# Altium schematic sheet LCD Controller.SchDoc: TFT PMOD
size Tabloid; Date: 7/9/2017; DrawnBy: Dave McCoy; Engineer: Dave McCoy; DocumentNumber: 2; Revision: B; SheetNumber: 2; SheetTotal: 4
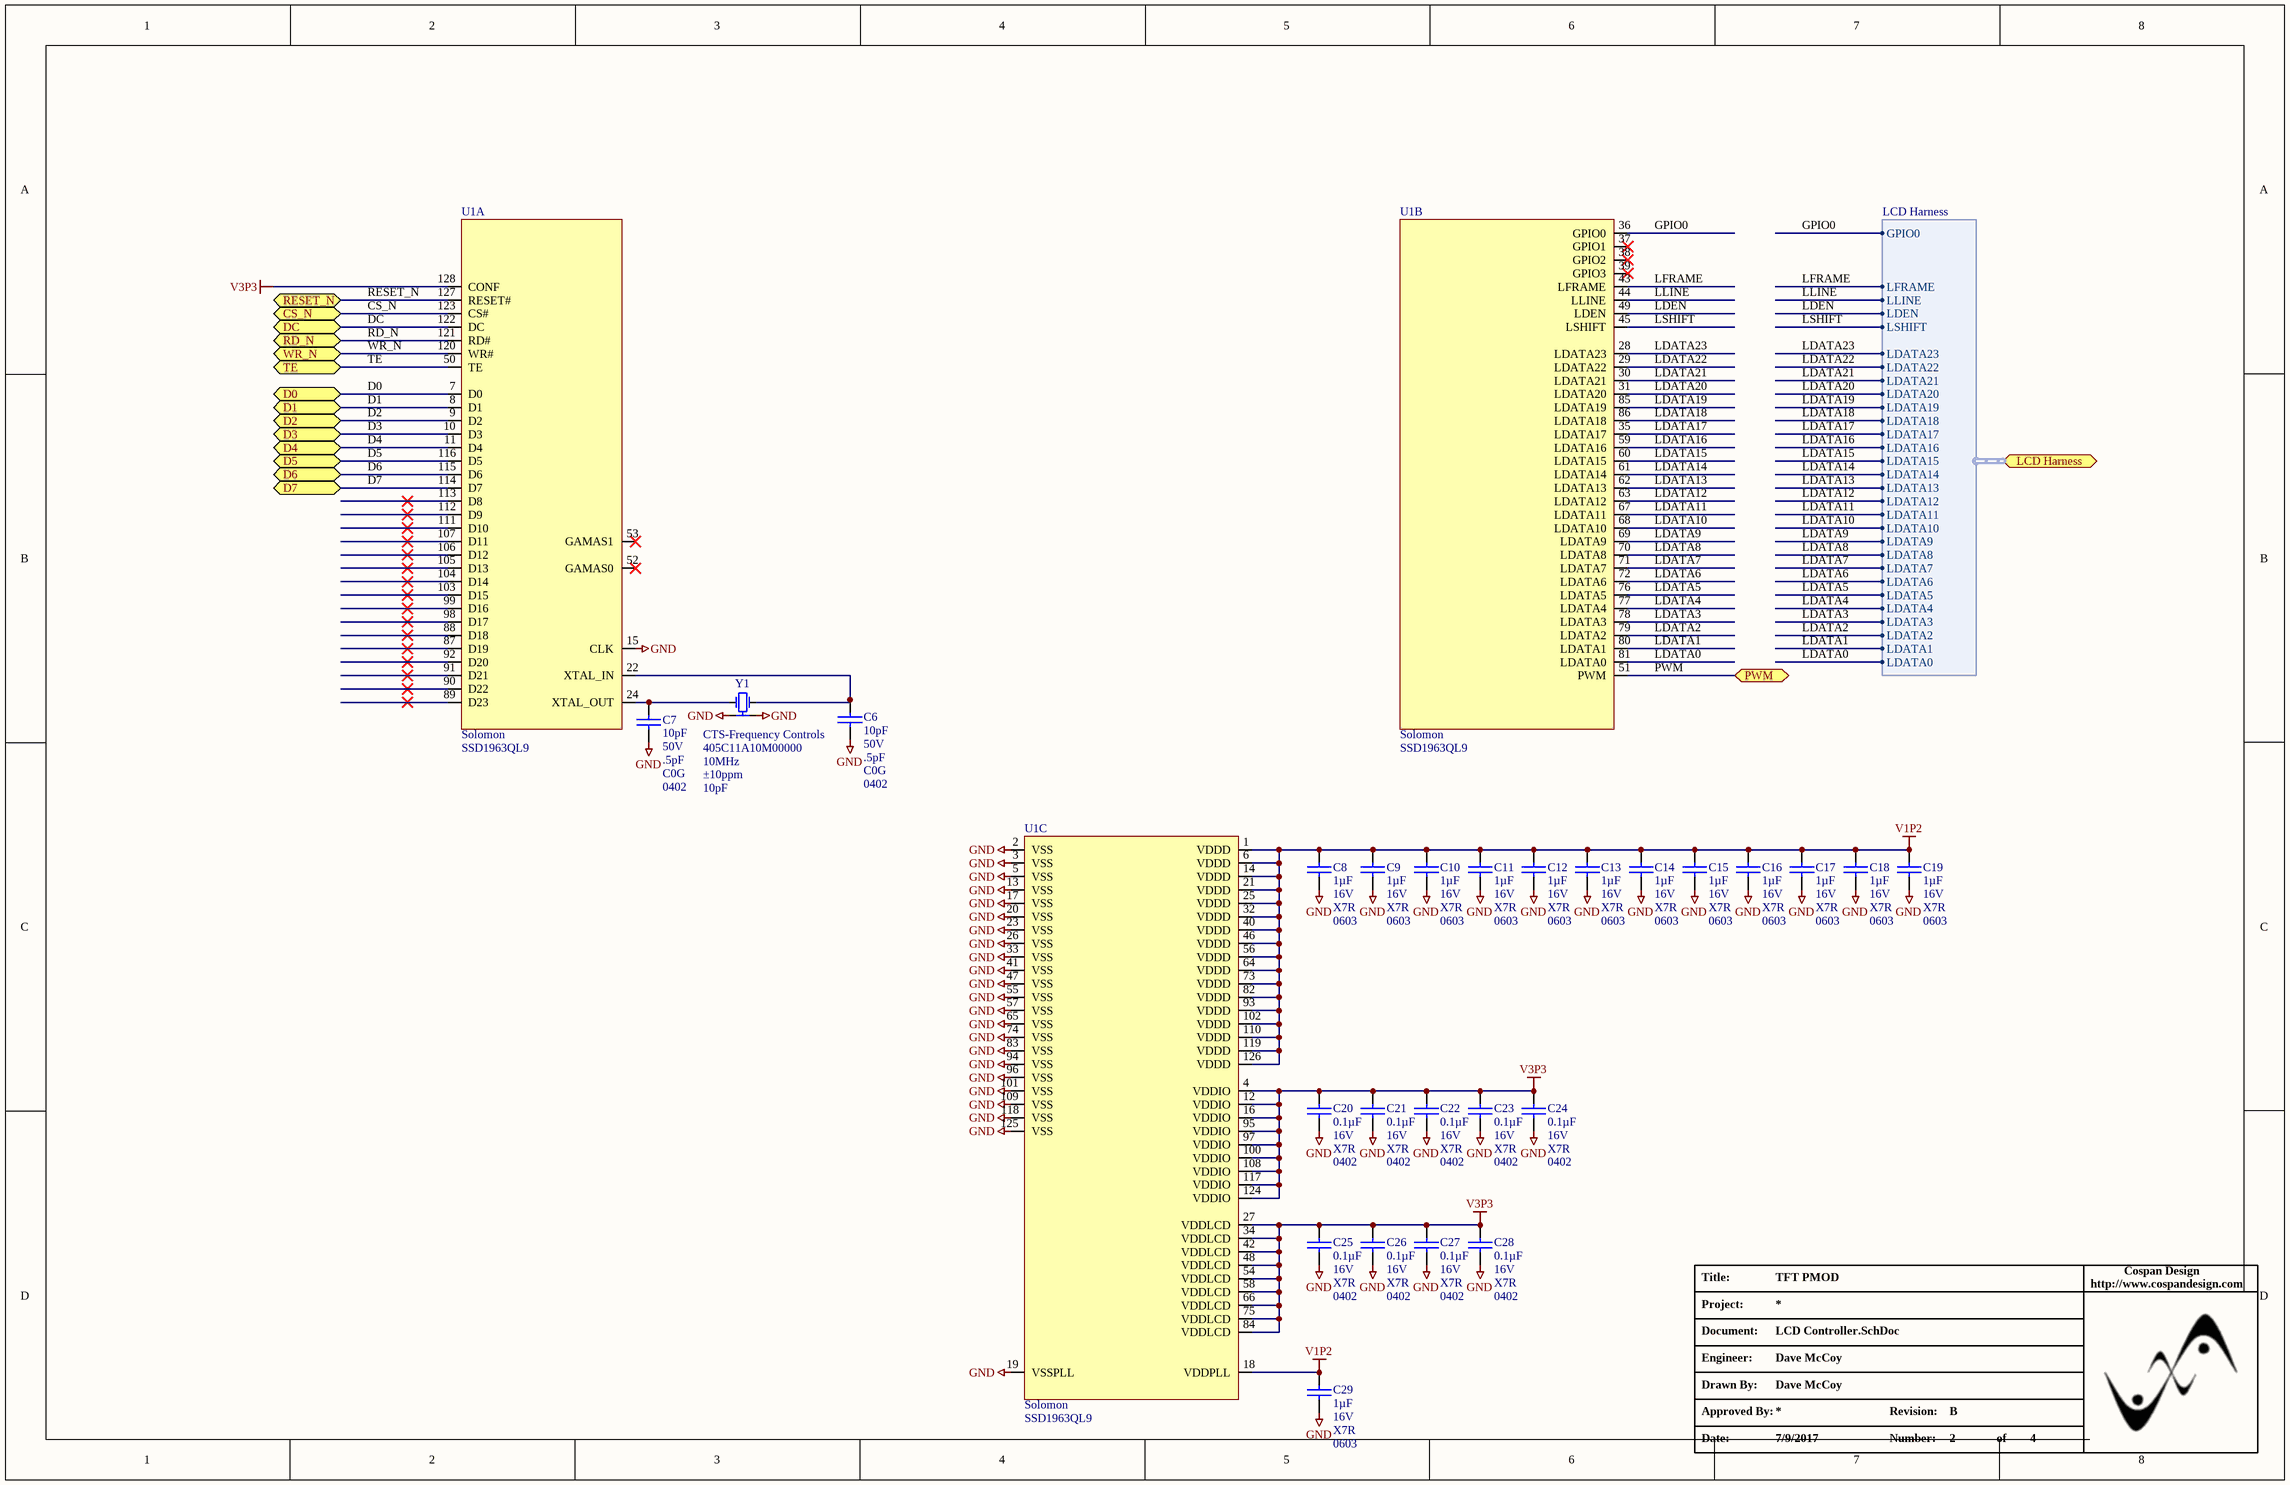
[diagram p0: LCD Controller.SchDoc]

## Parts
C6  Voltage - Rated: 50V  Tolerance: .5pF  Temperature Coefficient: C0G  Package / Case: 0402  [C_ERA-0402]  (hidden comment: 10pF)
C7  Voltage - Rated: 50V  Tolerance: .5pF  Temperature Coefficient: C0G  Package / Case: 0402  [C_ERA-0402]  (hidden comment: 10pF)
C8  Capacitance: 1µF  Voltage - Rated: 16V  Temperature Coefficient: X7R  Package / Case: 0603  [C_ERA-0603]  (hidden comment: C_0603_1µF_16V)
C9  Capacitance: 1µF  Voltage - Rated: 16V  Temperature Coefficient: X7R  Package / Case: 0603  [C_ERA-0603]  (hidden comment: C_0603_1µF_16V)
C10  Capacitance: 1µF  Voltage - Rated: 16V  Temperature Coefficient: X7R  Package / Case: 0603  [C_ERA-0603]  (hidden comment: C_0603_1µF_16V)
C11  Capacitance: 1µF  Voltage - Rated: 16V  Temperature Coefficient: X7R  Package / Case: 0603  [C_ERA-0603]  (hidden comment: C_0603_1µF_16V)
C12  Capacitance: 1µF  Voltage - Rated: 16V  Temperature Coefficient: X7R  Package / Case: 0603  [C_ERA-0603]  (hidden comment: C_0603_1µF_16V)
C13  Capacitance: 1µF  Voltage - Rated: 16V  Temperature Coefficient: X7R  Package / Case: 0603  [C_ERA-0603]  (hidden comment: C_0603_1µF_16V)
C14  Capacitance: 1µF  Voltage - Rated: 16V  Temperature Coefficient: X7R  Package / Case: 0603  [C_ERA-0603]  (hidden comment: C_0603_1µF_16V)
C15  Capacitance: 1µF  Voltage - Rated: 16V  Temperature Coefficient: X7R  Package / Case: 0603  [C_ERA-0603]  (hidden comment: C_0603_1µF_16V)
C16  Capacitance: 1µF  Voltage - Rated: 16V  Temperature Coefficient: X7R  Package / Case: 0603  [C_ERA-0603]  (hidden comment: C_0603_1µF_16V)
C17  Capacitance: 1µF  Voltage - Rated: 16V  Temperature Coefficient: X7R  Package / Case: 0603  [C_ERA-0603]  (hidden comment: C_0603_1µF_16V)
C18  Capacitance: 1µF  Voltage - Rated: 16V  Temperature Coefficient: X7R  Package / Case: 0603  [C_ERA-0603]  (hidden comment: C_0603_1µF_16V)
C19  Capacitance: 1µF  Voltage - Rated: 16V  Temperature Coefficient: X7R  Package / Case: 0603  [C_ERA-0603]  (hidden comment: C_0603_1µF_16V)
C20  Capacitance: 0.1µF  Voltage - Rated: 16V  Temperature Coefficient: X7R  Package / Case: 0402  [C_0402]  (hidden comment: 0.1uF)
C21  Capacitance: 0.1µF  Voltage - Rated: 16V  Temperature Coefficient: X7R  Package / Case: 0402  [C_0402]  (hidden comment: 0.1uF)
C22  Capacitance: 0.1µF  Voltage - Rated: 16V  Temperature Coefficient: X7R  Package / Case: 0402  [C_0402]  (hidden comment: 0.1uF)
C23  Capacitance: 0.1µF  Voltage - Rated: 16V  Temperature Coefficient: X7R  Package / Case: 0402  [C_0402]  (hidden comment: 0.1uF)
C24  Capacitance: 0.1µF  Voltage - Rated: 16V  Temperature Coefficient: X7R  Package / Case: 0402  [C_0402]  (hidden comment: 0.1uF)
C25  Capacitance: 0.1µF  Voltage - Rated: 16V  Temperature Coefficient: X7R  Package / Case: 0402  [C_0402]  (hidden comment: 0.1uF)
C26  Capacitance: 0.1µF  Voltage - Rated: 16V  Temperature Coefficient: X7R  Package / Case: 0402  [C_0402]  (hidden comment: 0.1uF)
C27  Capacitance: 0.1µF  Voltage - Rated: 16V  Temperature Coefficient: X7R  Package / Case: 0402  [C_0402]  (hidden comment: 0.1uF)
C28  Capacitance: 0.1µF  Voltage - Rated: 16V  Temperature Coefficient: X7R  Package / Case: 0402  [C_0402]  (hidden comment: 0.1uF)
C29  Capacitance: 1µF  Voltage - Rated: 16V  Temperature Coefficient: X7R  Package / Case: 0603  [C_ERA-0603]  (hidden comment: C_0603_1µF_16V)
U1  Manufacturer: Solomon  [LQFP128]  (hidden comment: U_SSD1963QL9)  (parts A,B,C of 3)
Y1  Manufacturer: CTS-Frequency Controls  Manufacturer Part Number: 405C11A10M00000  Frequency: 10MHz  Frequency Stability: ±10ppm  Load Capacitance: 10pF  [SMD_OSC_8MHZ]  (hidden comment: Y_SMD_10.00MHZ_10PF)

## Ports
CS_N, D0, D1, D2, D3, D4, D5, D6, D7, DC, LCD Harness (harness LCD Harness), PWM, RD_N, RESET_N, TE, WR_N

## Harnesses
LCD Harness: GPIO0, LFRAME, LLINE, LDEN, LSHIFT, LDATA0, LDATA1, LDATA2, LDATA3, LDATA4, LDATA5, LDATA6, LDATA7, LDATA8, LDATA9, LDATA10, LDATA11, LDATA12, LDATA13, LDATA14, LDATA15, LDATA16, LDATA17, LDATA18, LDATA19, LDATA20, LDATA21, LDATA22, LDATA23

## Nets
GND: C6.1 C7.1 C8.1 C9.1 C10.1 C11.1 C12.1 C13.1 C14.1 C15.1 C16.1 C17.1 C18.1 C19.1 C20.1 C21.1 C22.1 C23.1 C24.1 C25.1 C26.1 C27.1 C28.1 C29.1 U1.2(VSS) U1.3(VSS) U1.5(VSS) U1.13(VSS) U1.15(CLK) U1.17(VSS) U1.19(VSSPLL) U1.20(VSS) U1.23(VSS) U1.26(VSS) U1.33(VSS) U1.41(VSS) U1.47(VSS) U1.55(VSS) U1.57(VSS) U1.65(VSS) U1.74(VSS) U1.83(VSS) U1.94(VSS) U1.96(VSS) U1.101(VSS) U1.109(VSS) U1.118(VSS) U1.125(VSS) Y1.2 Y1.4
V1P2: C8.2 C9.2 C10.2 C11.2 C12.2 C13.2 C14.2 C15.2 C16.2 C17.2 C18.2 C19.2 C29.2 U1.1(VDDD) U1.6(VDDD) U1.14(VDDD) U1.18(VDDPLL) U1.21(VDDD) U1.25(VDDD) U1.32(VDDD) U1.40(VDDD) U1.46(VDDD) U1.56(VDDD) U1.64(VDDD) U1.73(VDDD) U1.82(VDDD) U1.93(VDDD) U1.102(VDDD) U1.110(VDDD) U1.119(VDDD) U1.126(VDDD)
V3P3: C20.2 C21.2 C22.2 C23.2 C24.2 C25.2 C26.2 C27.2 C28.2 U1.4(VDDIO) U1.12(VDDIO) U1.16(VDDIO) U1.27(VDDLCD) U1.34(VDDLCD) U1.42(VDDLCD) U1.48(VDDLCD) U1.54(VDDLCD) U1.58(VDDLCD) U1.66(VDDLCD) U1.75(VDDLCD) U1.84(VDDLCD) U1.95(VDDIO) U1.97(VDDIO) U1.100(VDDIO) U1.108(VDDIO) U1.117(VDDIO) U1.124(VDDIO) U1.128(CONF)
CS_N: U1.123(CS#) ; port CS_N
D0: U1.7(D0) ; port D0
D1: U1.8(D1) ; port D1
D2: U1.9(D2) ; port D2
D3: U1.10(D3) ; port D3
D4: U1.11(D4) ; port D4
D5: U1.116(D5) ; port D5
D6: U1.115(D6) ; port D6
D7: U1.114(D7) ; port D7
DC: U1.122(DC) ; port DC
GPIO0: U1.36(GPIO0) ; port LCD Harness.GPIO0
LDATA0: U1.81(LDATA0) ; port LCD Harness.LDATA0
LDATA1: U1.80(LDATA1) ; port LCD Harness.LDATA1
LDATA2: U1.79(LDATA2) ; port LCD Harness.LDATA2
LDATA3: U1.78(LDATA3) ; port LCD Harness.LDATA3
LDATA4: U1.77(LDATA4) ; port LCD Harness.LDATA4
LDATA5: U1.76(LDATA5) ; port LCD Harness.LDATA5
LDATA6: U1.72(LDATA6) ; port LCD Harness.LDATA6
LDATA7: U1.71(LDATA7) ; port LCD Harness.LDATA7
LDATA8: U1.70(LDATA8) ; port LCD Harness.LDATA8
LDATA9: U1.69(LDATA9) ; port LCD Harness.LDATA9
LDATA10: U1.68(LDATA10) ; port LCD Harness.LDATA10
LDATA11: U1.67(LDATA11) ; port LCD Harness.LDATA11
LDATA12: U1.63(LDATA12) ; port LCD Harness.LDATA12
LDATA13: U1.62(LDATA13) ; port LCD Harness.LDATA13
LDATA14: U1.61(LDATA14) ; port LCD Harness.LDATA14
LDATA15: U1.60(LDATA15) ; port LCD Harness.LDATA15
LDATA16: U1.59(LDATA16) ; port LCD Harness.LDATA16
LDATA17: U1.35(LDATA17) ; port LCD Harness.LDATA17
LDATA18: U1.86(LDATA18) ; port LCD Harness.LDATA18
LDATA19: U1.85(LDATA19) ; port LCD Harness.LDATA19
LDATA20: U1.31(LDATA20) ; port LCD Harness.LDATA20
LDATA21: U1.30(LDATA21) ; port LCD Harness.LDATA21
LDATA22: U1.29(LDATA22) ; port LCD Harness.LDATA22
LDATA23: U1.28(LDATA23) ; port LCD Harness.LDATA23
LDEN: U1.49(LDEN) ; port LCD Harness.LDEN
LFRAME: U1.43(LFRAME) ; port LCD Harness.LFRAME
LLINE: U1.44(LLINE) ; port LCD Harness.LLINE
LSHIFT: U1.45(LSHIFT) ; port LCD Harness.LSHIFT
PWM: U1.51(PWM) ; port PWM
RD_N: U1.121(RD#) ; port RD_N
RESET_N: U1.127(RESET#) ; port RESET_N
TE: U1.50(TE) ; port TE
WR_N: U1.120(WR#) ; port WR_N
NetC6_2: C6.2 U1.22(XTAL_IN) Y1.3
NetC7_2: C7.2 U1.24(XTAL_OUT) Y1.1

Not connected (* = marked no-connect by the designer): U1 37(GPIO1)* 38(GPIO2)* 39(GPIO3)* 52(GAMAS0)* 53(GAMAS1)* 87(D19)* 88(D18)* 89(D23)* 90(D22)* 91(D21)* 92(D20)* 98(D17)* 99(D16)* 103(D15)* 104(D14)* 105(D13)* 106(D12)* 107(D11)* 111(D10)* 112(D9)* 113(D8)*

## Notes on the sheet
- Title:
- http://www.cospandesign.com
- Cospan Design
- Project:
- Document:
- Engineer:
- Drawn By:
- Approved By:
- Revision:
- Date:
- Number:
- of

## Library data of the parts
C6 C7 = C_0402_10PF_50V: CAP CER 10PF 50V NP0 0402; Manufacturer: Taiyo Yuden; Manufacturer Part Number: UMK105CG100DV-F; Supplier 1: Digi-Key; Supplier Part Number 1: 587-1947-1-ND; RoHS: RoHS Compliant; Category: Capacitors; Stock 1: 47289; Pricing: 1=0.07, 10=0.045, 50=0.0216, 100=0.0162, 250=0.01172, 500=0.00864, 1000=0.00585, 5000=0.0045 (USD); Mounting Type: Surface Mount, MLCC; Operating Temperature: -55°C ~ 125°C; Applications: General Purpose; Ratings: -; Size / Dimension: 0.039" L x 0.020" W (1.00mm x 0.50mm); Height - Seated (Max): -; Thickness (Max): 0.022" (0.55mm); Lead Spacing: -; Features: -; Packaging: Cut Tape (CT); Lead Style: -; ComponentLink1URL: http://www.yuden.co.jp/productdata/catalog/en/mlcc02_e.pdf; ComponentLink1Description: http://www.yuden.co.jp/productdata/catalog/en/mlcc02_e.pdf; Capacitance: 10pF; COST_1: *; COST_100: *; COST_1000: *; MANF1: *; MANF1_PN: *; MANF2: *; MANF2_PN: *; MANF3: *; MANF3_PN: *; VENDOR1: *; VENDOR1_PN: *
C8-C19 C29 = C_0603_1µF_16V: CAP CER 1UF 16V X7R 0603; Manufacturer: Yageo; Manufacturer Part Number: CC0603KRX7R7BB105; Tolerance: 10%; Dissipation Factor: 5%; Supplier 1: Digikey; Stock 1: 531531; Pricing 1: 1=0.1, 10=0.053, 100=0.0237, 500=0.0169, 1000=0.0133 (USD); Mount: Surface Mount; Case/Package: 0603; Number of Pins: 2; Case Code (Metric): 1608; Case Code (Imperial): 0603; Min Operating Temperature: -55°C; Max Operating Temperature: 125°C; Voltage Rating: 16V; Package Quantity: 1; Packaging: Tape and Reel; Voltage Rating (DC): 16V; Dielectric: X7R; Termination: SMD/SMT; Composition: Ceramic; Length: 1.6mm; Height: 0.8mm; Width: 0.031inch; Thickness: 0.035inch; Depth: 0.8mm; Radiation Hardening: No; REACH SVHC: Unknown; Lead Free: Lead Free; Halogen Free: Halogen Free; ComponentLink1URL: https://datasheet.ciiva.com/176/mlccorderingcode-176788.pdf; ComponentLink1Description: https://datasheet.ciiva.com/176/mlccorderingcode-176788.pdf; ComponentLink2URL: https://datasheet.ciiva.com/176/mlccorderingcode-176789.pdf; ComponentLink2Description: https://datasheet.ciiva.com/176/mlccorderingcode-176789.pdf; ComponentLink3URL: https://datasheet.ciiva.com/176/mlccorderingcode-176790.pdf; ComponentLink3Description: https://datasheet.ciiva.com/176/mlccorderingcode-176790.pdf; ComponentLink4URL: https://datasheet.ciiva.com/5425/upy-gphc-x7r-6-3v-to-50v-8-12304-5425495.pdf; ComponentLink4Description: https://datasheet.ciiva.com/5425/upy-gphc-x7r-6-3v-to-50v-8-12304-5425495.pdf; ComponentLink5URL: https://datasheet.ciiva.com/16625/upy-gphc-x7r-6-3v-to-50v-8-16625527.pdf; ComponentLink5Description: https://datasheet.ciiva.com/16625/upy-gphc-x7r-6-3v-to-50v-8-16625527.pdf; ComponentLink6URL: https://datasheet.ciiva.com/8033/1734573-8033800.pdf; ComponentLink6Description: https://datasheet.ciiva.com/8033/1734573-8033800.pdf; ComponentLink7URL: https://datasheet.ciiva.com/8033/1734573-8033801.pdf; ComponentLink7Description: https://datasheet.ciiva.com/8033/1734573-8033801.pdf; ComponentLink8URL: https://datasheet.ciiva.com/28450/1489800-28450557.pdf; ComponentLink8Description: https://datasheet.ciiva.com/28450/1489800-28450557.pdf; ComponentLink9URL: https://datasheet.ciiva.com/7978/1489800-7978143.pdf; ComponentLink9Description: https://datasheet.ciiva.com/7978/1489800-7978143.pdf; Supplier Part Number 1: 311-1446-6-ND
C20-C28 = C_0402_0.1UF_16V: CAP CER .10UF 16V X7R 0402; Manufacturer: TDK Corporation; Manufacturer Part Number: C1005X7R1C104K050BC; Tolerance: ±10%; Supplier 1: Digi-Key; Supplier Part Number 1: 445-4952-1-ND; RoHS: RoHS Compliant; Category: Capacitors; Stock 1: 2696686; Mounting Type: Surface Mount, MLCC; Features: Low ESL; Lead Spacing: -; Packaging: Cut Tape (CT); ComponentLink1URL: https://product.tdk.com/info/en/catalog/datasheets/mlcc_commercial_general_en.pdf; ComponentLink1Description: https://product.tdk.com/info/en/catalog/datasheets/mlcc_commercial_general_en.pdf; Operating Temperature: -55°C ~ 125°C; Pricing 1: 1=0.1, 10=0.05, 100=0.0231, 250=0.01892, 500=0.01618, 1000=0.0126, 5000=0.0105 (USD); Part Status: Not For New Designs; Ratings: -; Applications: General Purpose; Failure Rate: -; Size / Dimension: 0.039" L x 0.020" W (1.00mm x 0.50mm); Height - Seated (Max): -; Thickness (Max): 0.022" (0.55mm); Lead Style: -
U1 = U_SSD1963QL9: SSD1963QL9; Manufacturer Part Number: SSD1963QL9
Y1 = Y_SMD_10.00MHZ_10PF: CRYSTAL 10MHZ 10PF SMD; ESR (Equivalent Series Resistance): 60 Ohm; Operating Mode: Fundamental; Supplier 1: Digi-Key; Supplier Part Number 1: CTX832CT-ND; RoHS: RoHS Compliant; Category: Crystals and Oscillators; Stock 1: 2457; Pricing: 1=1.23, 10=1.089, 50=1.017, 100=0.9, 500=0.8505 (USD); Packaging: Cut Tape (CT); Type: MHz Crystal; Frequency Tolerance: ±10ppm; Operating Temperature: -20°C ~ 70°C; Ratings: -; Mounting Type: Surface Mount; Package / Case: 4-SMD, No Lead (DFN, LCC); Size / Dimension: 0.197" L x 0.126" W (5.00mm x 3.20mm); Height: 0.041" (1.05mm); ComponentLink1URL: http://www.ctscorp.com/components/Datasheets/008-0253-0.pdf; ComponentLink1Description: http://www.ctscorp.com/components/Datasheets/008-0253-0.pdf